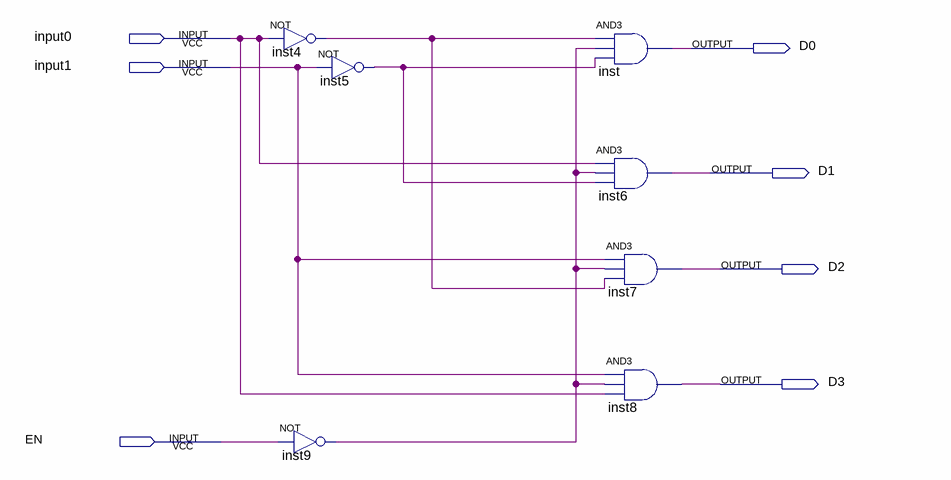
[diagram p0: schematic sheet]
// Quartus schematic Dec2_4.bdf as structural Verilog: 7 symbols, 7 pins
module Dec2_4 (
  input  input0,
  input  input1,
  input  EN,
  output D0,
  output D1,
  output D2,
  output D3
);

  wire inst4_out, inst5_out, inst9_out;

  not inst4 (inst4_out, input0);
  not inst9 (inst9_out, EN);
  not inst5 (inst5_out, input1);
  and inst (D0, inst4_out, inst9_out, inst5_out);
  and inst6 (D1, input0, inst9_out, inst5_out);
  and inst7 (D2, input1, inst9_out, inst4_out);
  and inst8 (D3, input1, inst9_out, input0);
endmodule
